# EAGLE design clock-matrix (EAGLE 9.6.2)
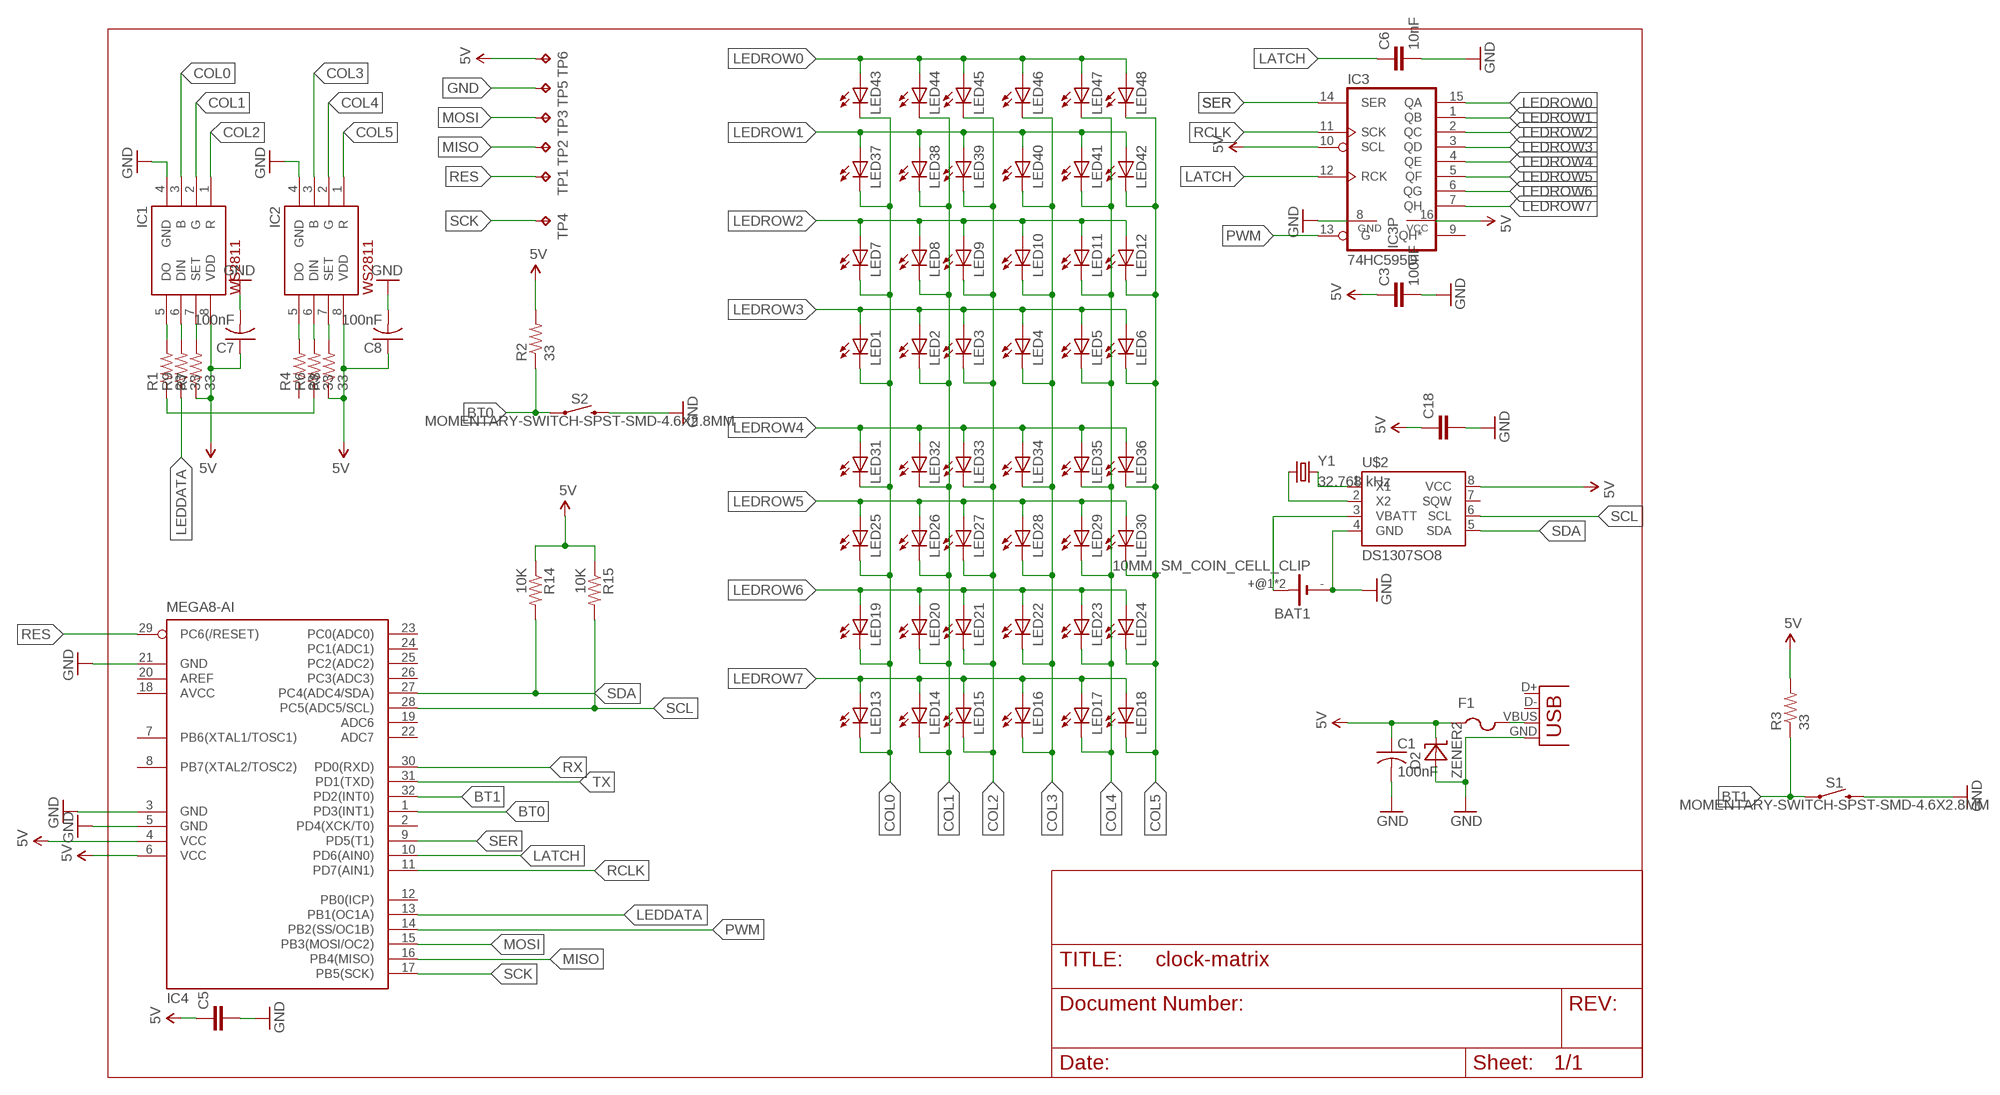
[diagram p0: schematic, sheet 1]

## Parts
BAT1  10MM_SM_COIN_CELL_CLIP  [10MM_SM_COIN_CELL_CLIP]
C1  100nF  C-USC0603  [C0603]
C3  100nF  C-EUC0603  [C0603]
C5  C-EUC0603  [C0603]
C6  10nF  C-EUC0603  [C0603]
C7  100nF  C-USC0603  [C0603]
C8  100nF  C-USC0603  [C0603]
C18  C-EUC0603  [C0603]
D2  ZENER2  [SOD123]
F1  PTCFUSE-1206  [R1206]
IC1  WS2811-SOP8  [SO08-SKINNYPADS]
IC2  WS2811-SOP8  [SO08-SKINNYPADS]
IC3  74HC595D  [SO16]
IC4  MEGA8-AI  [TQFP32-08]
LED1  LED1206  [LED-1206]
LED2  LED1206  [LED-1206]
LED3  LED1206  [LED-1206]
LED4  LED1206  [LED-1206]
LED5  LED1206  [LED-1206]
LED6  LED1206  [LED-1206]
LED7  LED1206  [LED-1206]
LED8  LED1206  [LED-1206]
LED9  LED1206  [LED-1206]
LED10  LED1206  [LED-1206]
LED11  LED1206  [LED-1206]
LED12  LED1206  [LED-1206]
LED13  LED1206  [LED-1206]
LED14  LED1206  [LED-1206]
LED15  LED1206  [LED-1206]
LED16  LED1206  [LED-1206]
LED17  LED1206  [LED-1206]
LED18  LED1206  [LED-1206]
LED19  LED1206  [LED-1206]
LED20  LED1206  [LED-1206]
LED21  LED1206  [LED-1206]
LED22  LED1206  [LED-1206]
LED23  LED1206  [LED-1206]
LED24  LED1206  [LED-1206]
LED25  LED1206  [LED-1206]
LED26  LED1206  [LED-1206]
LED27  LED1206  [LED-1206]
LED28  LED1206  [LED-1206]
LED29  LED1206  [LED-1206]
LED30  LED1206  [LED-1206]
LED31  LED1206  [LED-1206]
LED32  LED1206  [LED-1206]
LED33  LED1206  [LED-1206]
LED34  LED1206  [LED-1206]
LED35  LED1206  [LED-1206]
LED36  LED1206  [LED-1206]
LED37  LED1206  [LED-1206]
LED38  LED1206  [LED-1206]
LED39  LED1206  [LED-1206]
LED40  LED1206  [LED-1206]
LED41  LED1206  [LED-1206]
LED42  LED1206  [LED-1206]
LED43  LED1206  [LED-1206]
LED44  LED1206  [LED-1206]
LED45  LED1206  [LED-1206]
LED46  LED1206  [LED-1206]
LED47  LED1206  [LED-1206]
LED48  LED1206  [LED-1206]
R1  33  R-US_R0603  [R0603]
R2  33  R-US_R0603  [R0603]
R3  33  R-US_R0603  [R0603]
R4  33  R-US_R0603  [R0603]
R6  33  R-US_R0603  [R0603]
R7  33  R-US_R0603  [R0603]
R8  33  R-US_R0603  [R0603]
R9  33  R-US_R0603  [R0603]
R14  10K  R-US_R0603  [R0603]
R15  10K  R-US_R0603  [R0603]
S1  MOMENTARY-SWITCH-SPST-SMD-4.6X2.8MM  [TACTILE_SWITCH_SMD_4.6X2.8MM]
S2  MOMENTARY-SWITCH-SPST-SMD-4.6X2.8MM  [TACTILE_SWITCH_SMD_4.6X2.8MM]
TP1  TPTP10R  [TP10R]
TP2  TPTP10R  [TP10R]
TP3  TPTP10R  [TP10R]
TP4  TPTP10R  [TP10R]
TP5  TPTP10R  [TP10R]
TP6  TPTP10R  [TP10R]
U$2  DS1307SO8  [SO08]
X2  USB-MICROB  [USB-MICROB]
Y1  32.768 kHz  CRYSTALTC26H  [TC26H]

## Nets
5V: C1.1 C3.1 C5.1 C7.1 C8.1 C18.1 D2.C F1.1 IC1.8(VDD) IC2.8(VDD) IC3.10(SCL) IC3.16(VCC) IC4.4(VCC) IC4.6(VCC) R2.2 R3.2 R7.1 R8.1 R14.1 R15.1 TP6.TP U$2.8(VCC)
BT0: IC4.1(PD3(INT1)) R2.1 S2.1 S2.2
BT1: IC4.32(PD2(INT0)) R3.1 S1.1 S1.2
COL0: IC1.3(B) LED1.C LED7.C LED13.C LED19.C LED25.C LED31.C LED37.C LED43.C
COL1: IC1.2(G) LED2.C LED8.C LED14.C LED20.C LED26.C LED32.C LED38.C LED44.C
COL2: IC1.1(R) LED3.C LED9.C LED15.C LED21.C LED27.C LED33.C LED39.C LED45.C
COL3: IC2.3(B) LED4.C LED10.C LED16.C LED22.C LED28.C LED34.C LED40.C LED46.C
COL4: IC2.2(G) LED5.C LED11.C LED17.C LED23.C LED29.C LED35.C LED41.C LED47.C
COL5: IC2.1(R) LED6.C LED12.C LED18.C LED24.C LED30.C LED36.C LED42.C LED48.C
GND: BAT1.- C1.2 C3.2 C5.2 C6.2 C7.2 C8.2 C18.2 D2.A IC1.4(GND) IC2.4(GND) IC3.8(GND) IC4.3(GND) IC4.5(GND) IC4.21(GND) S1.3 S1.4 S2.3 S2.4 TP5.TP U$2.4(GND) X2.GND
LATCH: C6.1 IC3.12(RCK) IC4.10(PD6(AIN0))
LEDDATA: IC4.13(PB1(OC1A)) R9.1
LEDROW0: IC3.15(QA) LED43.A LED44.A LED45.A LED46.A LED47.A LED48.A
LEDROW1: IC3.1(QB) LED37.A LED38.A LED39.A LED40.A LED41.A LED42.A
LEDROW2: IC3.2(QC) LED7.A LED8.A LED9.A LED10.A LED11.A LED12.A
LEDROW3: IC3.3(QD) LED1.A LED2.A LED3.A LED4.A LED5.A LED6.A
LEDROW4: IC3.4(QE) LED31.A LED32.A LED33.A LED34.A LED35.A LED36.A
LEDROW5: IC3.5(QF) LED25.A LED26.A LED27.A LED28.A LED29.A LED30.A
LEDROW6: IC3.6(QG) LED19.A LED20.A LED21.A LED22.A LED23.A LED24.A
LEDROW7: IC3.7(QH) LED13.A LED14.A LED15.A LED16.A LED17.A LED18.A
MISO: IC4.16(PB4(MISO)) TP2.TP
MOSI: IC4.15(PB3(MOSI/OC2)) TP3.TP
N$1: R1.1 R6.1
N$2: IC1.5(DO) R1.2
N$3: IC2.6(DIN) R6.2
N$4: IC1.7(SET) R7.2
N$5: IC2.5(DO) R4.2
N$7: IC1.6(DIN) R9.2
N$9: BAT1.+@1(+) BAT1.+@2(+) U$2.3(VBATT)
N$10: U$2.2(X2) Y1.1
N$11: U$2.1(X1) Y1.2
N$13: IC2.7(SET) R8.2
N$41: F1.2 X2.VBUS
PWM: IC3.13(G) IC4.14(PB2(SS/OC1B))
RCLK: IC3.11(SCK) IC4.11(PD7(AIN1))
RES: IC4.29(PC6(/RESET)) TP1.TP
RX: IC4.30(PD0(RXD))
SCK: IC4.17(PB5(SCK)) TP4.TP
SCL: IC4.28(PC5(ADC5/SCL)) R15.2 U$2.6(SCL)
SDA: IC4.27(PC4(ADC4/SDA)) R14.2 U$2.5(SDA)
SER: IC3.14(SER) IC4.9(PD5(T1))
TX: IC4.31(PD1(TXD))
Unconnected: IC3.9(QH*) IC4.2(PD4(XCK/T0)) IC4.7(PB6(XTAL1/TOSC1)) IC4.8(PB7(XTAL2/TOSC2)) IC4.12(PB0(ICP)) IC4.19(ADC6) IC4.20(AREF) IC4.22(ADC7) IC4.23(PC0(ADC0)) IC4.24(PC1(ADC1)) IC4.25(PC2(ADC2)) IC4.26(PC3(ADC3)) R4.1 U$2.7(SQW) X2.D+ X2.D-

## Power pins joined to a net without a drawn wire
AVCC: IC4.18(AVCC)

## Library data of the parts
BAT1 = battery:10MM_SM_COIN_CELL_CLIP: Battery cell clip for CR927 Source: KEYSTONE ELECTRONICS CORP. www.keyelco.com, ASTORIA, N.Y. 11105-2017 PART ANME 10mm SM COIN CELl CLIP DWG NO. 3030
C1 C7 C8 = adafruit:C-US: CAPACITOR, American symbol
C3 C5 C6 C18 = rcl:C-EU: CAPACITOR, European symbol
D2 = smt_diodes:ZENER
F1 = adafruit:PTCFUSE: PTC fuses, resettable thermistors
IC1 IC2 = adafruit:WS2811
IC3 = 74xx-eu:74*595: 8-bit SHIFT REGISTER, output latch
IC4 = atmel:MEGA8: MICROCONTROLLER 8 Kbytes FLASH, 1 kbytes SRAM, 512 bytes EEPROM, USART, 6-channel 10 bit ADC, 2-channel 8 bit ADC Pin compatible with Atmega48, ATMega88, ATMega168 Source: avr.lbr; MPN: ATMEGA8-16AU; OC_FARNELL: 9171371; OC_NEWARK: 73M8863
LED1-LED48 = SparkFun:LED: LEDs Standard schematic elements and footprints for 5mm, 3mm, 1206, and 0603 sized LEDs. 5mm - Spark Fun Electronics SKU : COM-00529 (and others)
R1-R4 R6-R9 = adafruit:R-US_: RESISTOR, American symbol
R14 R15 = rcl:R-US_: RESISTOR, American symbol
S1 S2 = SparkFun-Switches:MOMENTARY-SWITCH-SPST: Momentary Switch (Pushbutton) - SPST Normally-open (NO) SPST momentary switches (buttons, pushbuttons). Variants PTH-12MM - 12mm square, through-hole Momentary Pushbutton Switch - 12mm Square <https://www.sparkfun.com/products/9190> (COM-09190) PTH-6.0MM, PTH-6.0MM-KIT - 6.0mm square, through-hole Mini Pushbutton Switch <https://www.sparkfun.com/products/97> (COM-00097) KIT package intended for soldering kit's - only one side of pads' copper is exposed. PTH-RIGHT-ANGLE-KIT - Right-angle, through-hole Right Angle Tactile Button <https://www.sparkfun.com/products/10791> - Used on SparkFun BigTime Watch Kit <https://www.sparkfun.com/products/11734> SMD-12MM - 12mm square, surface-mount Tactile Button - SMD (12mm) <https://www.sparkfun.com/products/12993> (COM-12993) Used on SparkFun PicoBoard <https://www.sparkfun.com/products/11888> SMD-4.5MM - 4.5mm Square Trackball Switch Used on SparkFun Blackberry Trackballer Breakout <https://www.sparkfun.com/products/13169> SMD-4.6MMX2.8MM - 4.60mm x 2.80mm, surface mount Used on SparkFun SAMD21 Mini Breakout <https://www.sparkfun.com/products/13664> SMD-5.2MM, SMD-5.2-REDUNDANT - 5.2mm square, surface-mount Mini Pushbutton Switch - SMD <https://www.sparkfun.com/products/8720> (COM-08720) Used on Arduino Pro Mini <https://www.sparkfun.com/products/11114> REDUNDANT package connects both switch circuits together SMD-6.0X3.5MM - 6.0 x 3.5mm, surface mount Momentary Reset Switch SMD <https://www.sparkfun.com/products/8229> (COM-08229) SMD-6.2MM-TALL - 6.2mm square, surface mount Tactile Button - SMD (6mm) <https://www.sparkfun.com/products/12992> Used on SparkFun Digital Sandbox <https://www.sparkfun.com/products/12651> SMD-RIGHT-ANGLE - Right-angle, surface mount Used on SparkFun Block for Intel® Edison - Arduino <https://www.sparkfun.com/products/13036>; PROD_ID: SWCH-13065
TP1-TP6 = testpad:TP: Test pad
U$2 = SparkFun:DS1307
X2 = SparkFun:USB: USB Connectors USB-B-PTH is fully proven SKU : PRT-00139 USB-miniB is fully proven SKU : PRT-00587 USB-A-PCB is untested. USB-A-H is throughly reviewed, but untested. Spark Fun Electronics SKU : PRT-00437 USB-B-SMT is throughly reviewed, but untested. Needs silkscreen touching up. USB-A-S has not been used/tested USB-MB-H has not been used/tested
Y1 = SparkFun:CRYSTAL: Crystals Various standard crystals. Proven footprints. Spark Fun Electronics SKU : COM-00534

## Board
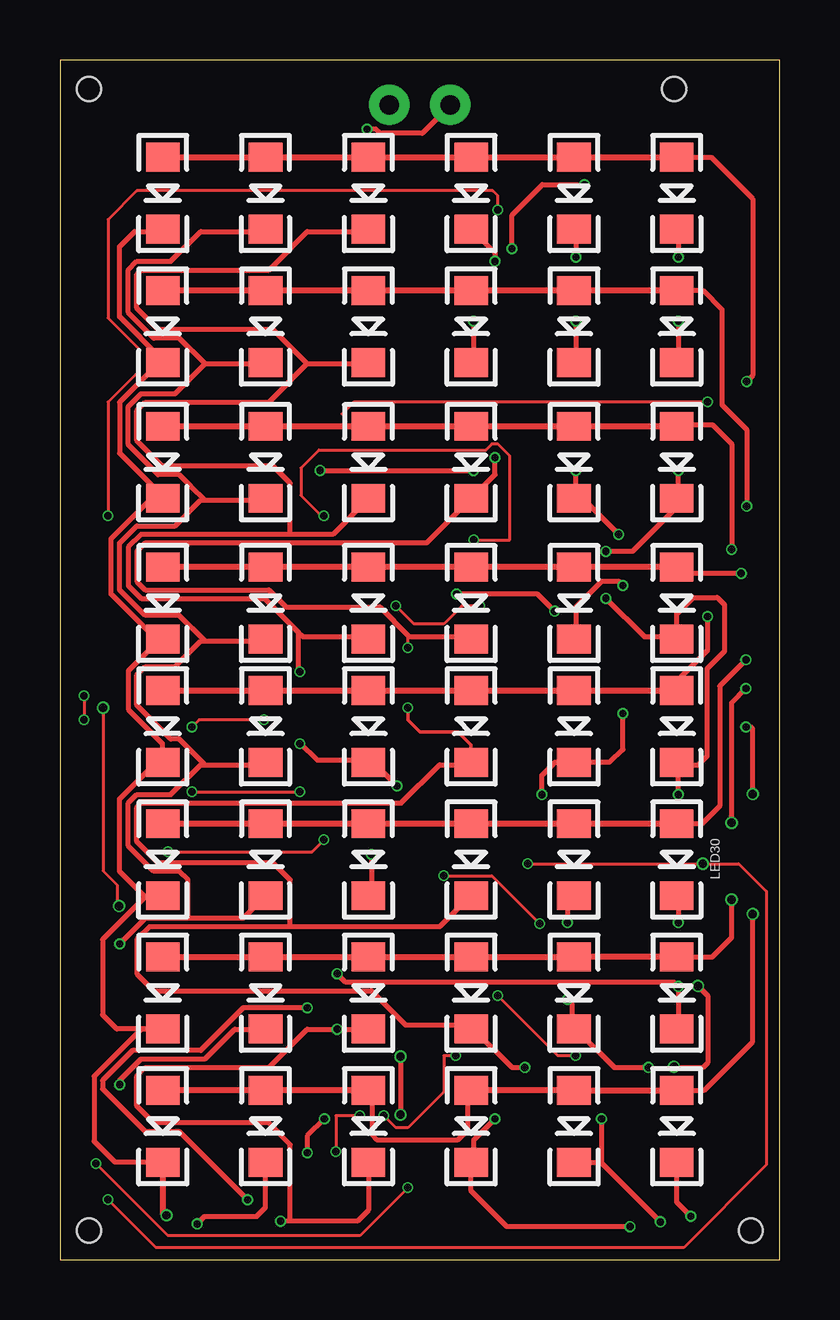
[diagram p1: board, top side]
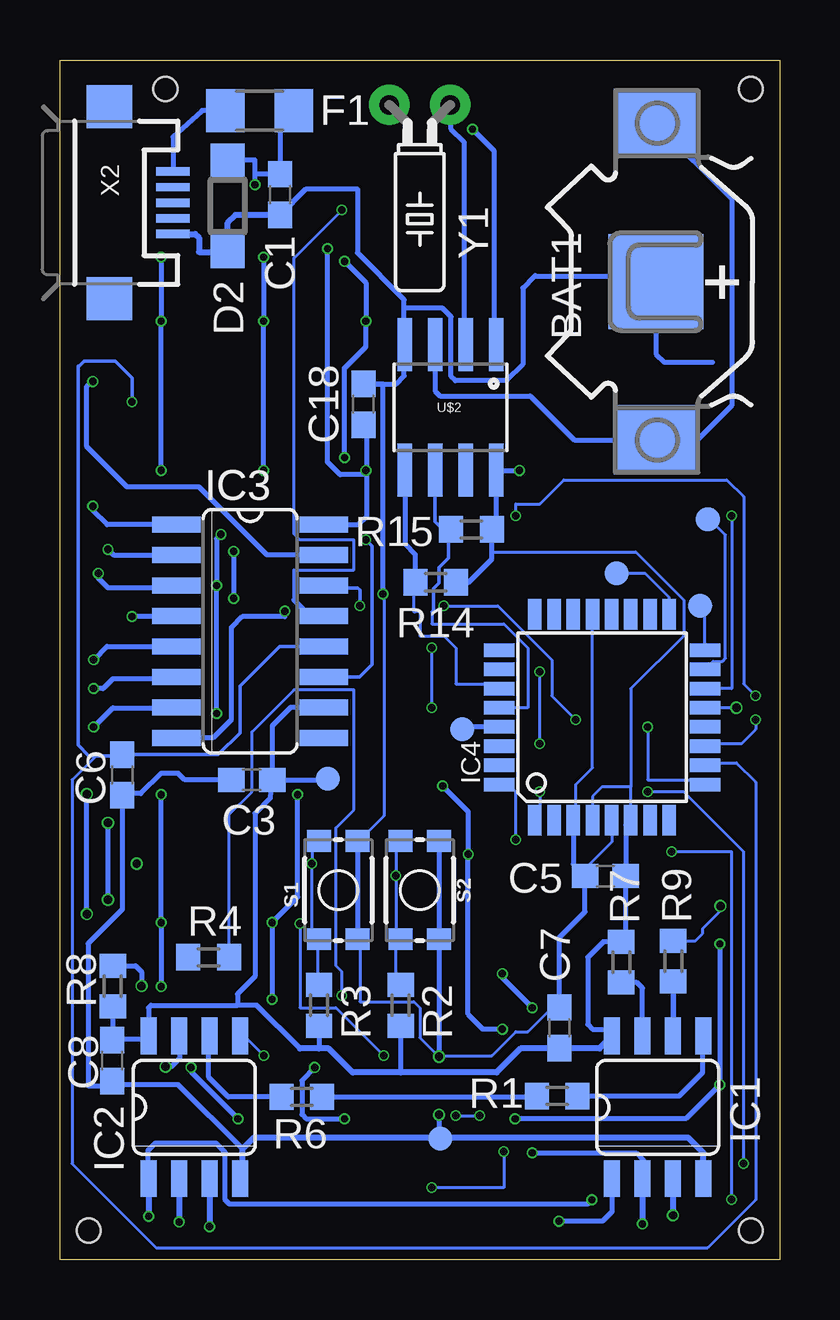
[diagram p2: board, bottom side, seen from below]

Size 30 x 50 mm. Coordinates in mm from the lower left corner, seen from the top.
Outline: 0,0 30,0 30,50 0,50 0,0
Copper layers (1*16): Top 0.035mm / dielectric 1.6mm / Bottom 0.035mm
Design rules "jlcpcb-2layers *": minimum track width 5mil, minimum drill 0.3mm, track to track 5mil, track to pad 5mil, pad to pad 5mil, via to via 5mil, smd to smd 5mil, copper to edge 0.2mm, drill to drill 6mil, minimum pad ring 10mil, minimum via ring 3mil, stop-mask expansion 4mil, vias tented up to drill 14mil, thermal gap 10mil
Holes 1 mm at 1.2,1.2 28.8,1.2 1.2,48.8 25.6,48.8

### Footprints (pad centres in the part's own frame; a part is rotated, then mirrored left to right if it is on the bottom)
10MM_SM_COIN_CELL_CLIP = smd 2.9 x 3.5: +@1 -6.6,0; +@2 6.6,0 | smd 3.96 x 3.96: - 0,0
C0603 = smd 1.1 x 1: 1 -0.85,0; 2 0.85,0
SOD123 = smd 1.4 x 1.4: A 1.9,0; C -1.9,0
R1206 = smd 1.6 x 1.803: 1 -1.422,0; 2 1.422,0
SO08-SKINNYPADS = smd 0.66 x 1.524: 1 -1.905,-2.973; 2 -0.635,-2.973; 3 0.635,-2.973; 4 1.905,-2.973; 5 1.905,2.973; 6 0.635,2.973; 7 -0.635,2.973; 8 -1.905,2.973
SO16 = smd 0.66 x 2.032: 1 -4.445,-3.073; 2 -3.175,-3.073; 3 -1.905,-3.073; 4 -0.635,-3.073; 5 0.635,-3.073; 6 1.905,-3.073; 7 3.175,-3.073; 8 4.445,-3.073; 9 4.445,3.073; 10 3.175,3.073; 11 1.905,3.073; 12 0.635,3.073; 13 -0.635,3.073; 14 -1.905,3.073; 15 -3.175,3.073; 16 -4.445,3.073
TQFP32-08 = smd 1.27 x 0.559: 1 -4.293,2.8; 2 -4.293,2; 3 -4.293,1.2; 4 -4.293,0.4; 5 -4.293,-0.4; 6 -4.293,-1.2; 7 -4.293,-2; 8 -4.293,-2.8; 17 4.293,-2.8; 18 4.293,-2; 19 4.293,-1.2; 20 4.293,-0.4; 21 4.293,0.4; 22 4.293,1.2; 23 4.293,2; 24 4.293,2.8 | smd 0.559 x 1.27: 9 -2.8,-4.293; 10 -2,-4.293; 11 -1.2,-4.293; 12 -0.4,-4.293; 13 0.4,-4.293; 14 1.2,-4.293; 15 2,-4.293; 16 2.8,-4.293; 25 2.8,4.293; 26 2,4.293; 27 1.2,4.293; 28 0.4,4.293; 29 -0.4,4.293; 30 -1.2,4.293; 31 -2,4.293; 32 -2.8,4.293
LED-1206 = smd 1.2 x 1.4: A -1.5,0; C 1.5,0
R0603 = smd 1 x 1.1: 1 -0.85,0; 2 0.85,0
TACTILE_SWITCH_SMD_4.6X2.8MM = smd 0.9 x 1: 1 -2.05,-0.8; 2 2.05,-0.8; 3 2.05,0.8; 4 -2.05,0.8
TP10R = smd 1 x 1: TP 0,0
SO08 = smd 0.61 x 2.21: 1 -1.905,-2.616; 2 -0.635,-2.616; 3 0.635,-2.616; 4 1.905,-2.616; 5 1.905,2.616; 6 0.635,2.616; 7 -0.635,2.616; 8 -1.905,2.616
USB-MICROB = smd 0.35 x 1.4: D+ 0,2.65; D- -0.65,2.65; GND 1.3,2.65; ID 0.65,2.65; VBUS -1.3,2.65 | smd 1.8 x 1.9: MT1 -4,0; MT2 4,0
TC26H = drill 0.813 pad 1.676: 1 -1.27,0; 2 1.27,0

### Placement (x,y rotation side)
BAT1  5.15,40.76 270 bottom
C1  20.83,44.39 270 bottom
C3  22,20 180 bottom
C5  7.26,15.98 180 bottom
C6  27.4,20.2 270 bottom
C7  9.17,9.66 90 bottom
C8  27.83,8.29 270 bottom
C18  17.34,35.65 90 bottom
D2  23.01,43.92 270 bottom
F1  21.68,47.89 180 bottom
IC1  5.08,6.35 0 bottom
IC2  24.4,6.35 0 bottom
IC3  22.07,26.19 270 bottom
IC4  7.4,22.6 90 bottom
LED1  4.29,27.36 270 top
LED2  8.57,27.36 270 top
LED3  12.86,27.36 270 top
LED4  17.14,27.36 270 top
LED5  21.43,27.36 270 top
LED6  25.71,27.36 270 top
LED7  4.29,33.23 270 top
LED8  8.57,33.23 270 top
LED9  12.86,33.23 270 top
LED10  17.14,33.23 270 top
LED11  21.43,33.23 270 top
LED12  25.71,33.23 270 top
LED13  4.29,5.56 270 top
LED14  8.57,5.56 270 top
LED15  12.86,5.56 270 top
LED16  17.14,5.56 270 top
LED17  21.43,5.56 270 top
LED18  25.71,5.56 270 top
LED19  4.29,11.11 270 top
LED20  8.57,11.11 270 top
LED21  12.86,11.11 270 top
LED22  17.14,11.11 270 top
LED23  21.43,11.11 270 top
LED24  25.71,11.11 270 top
LED25  4.29,16.67 270 top
LED26  8.57,16.67 270 top
LED27  12.86,16.67 270 top
LED28  17.14,16.67 270 top
LED29  21.43,16.67 270 top
LED30  25.71,16.67 270 top
LED31  4.29,22.22 270 top
LED32  8.57,22.22 270 top
LED33  12.86,22.22 270 top
LED34  17.14,22.22 270 top
LED35  21.43,22.22 270 top
LED36  25.71,22.22 270 top
LED37  4.29,38.89 270 top
LED38  8.57,38.89 270 top
LED39  12.86,38.89 270 top
LED40  17.14,38.89 270 top
LED41  21.43,38.89 270 top
LED42  25.71,38.89 270 top
LED43  4.29,44.44 270 top
LED44  8.57,44.44 270 top
LED45  12.86,44.44 270 top
LED46  17.14,44.44 270 top
LED47  21.43,44.44 270 top
LED48  25.71,44.44 270 top
R1  9.27,6.82 0 bottom
R2  15.8,10.6 270 bottom
R3  19.2,10.6 270 bottom
R4  23.8,12.6 0 bottom
R6  19.92,6.78 180 bottom
R7  6.6,12.4 270 bottom
R8  27.8,11.4 90 bottom
R9  4.43,12.44 270 bottom
R14  14.33,28.23 180 bottom
R15  12.85,30.43 180 bottom
S1  18.4,15.4 270 bottom
S2  15,15.4 270 bottom
TP1  13.23,22.1 0 bottom
TP2  3.31,27.25 0 bottom
TP3  2.99,30.85 0 bottom
TP4  6.8,28.6 0 bottom
TP5  14.15,5.05 0 bottom
TP6  18.83,20.05 0 bottom
U$2  13.72,35.52 180 bottom
X2  27.94,44.05 270 bottom
Y1  15,48.13 180 bottom

### Tracks (layer width: path | path; a pad name or v marks a point on that pad's centre or on a via)
5V  (via drill 0.3)
  Top 0.203: v21.87,44.81 20.11,44.81 18.85,43.54 v18.85,42.14 | v10.85,32.89 v17.25,32.89
  Bottom 0.127: 6.2,19.7 7.4,19.7 7.8,19.3 IC4.4 | IC4.6 6.2,19.7 | 6.2,19.7 6.2,23.8 4,26 4,27.5 6,29.5 12,29.5
  Bottom 0.203: R14.1 13.45,28.2 13,28.2 12,29.2 12,29.5 R15.1 11.81,30.61 U$2.8 11.73,32.89 v10.85,32.89 | 21.87,45.24 C1.1 20.83,47.52 F1.1 | D2.C 22.99,45.84 21.87,45.84 21.87,45.24 | C8.1 27.77,9.2 | 27.77,9.2 26.3,9.2 | 20,8.8 21.8,10.6 22.6,10.6 | 22.6,10.6 26.2,10.6 26.3,10.49 IC2.8 | IC3.16 17.57,30.64 17.2,31 17.2,32.72 | 17.2,32.72 17.2,32.89 | 17.2,32.89 17.2,34.66 C18.1 | v21.87,44.81 21.87,45.24 | v18.85,42.14 18.85,33.25 18.31,32.72 17.2,32.72 | C7.1 9.25,8.89 9.25,8.8 | C3.1 21.22,19.25 21.87,18.6 21.87,11.8 22.6,11.07 22.6,10.6 | C3.1 18.88,20 TP6.TP 18.6,20.05 | v17.25,32.89 17.2,32.89 | IC3.10 20.39,23.02 21.15,22.25 C3.1 | R3.2 19.2,8.8 | R2.2 15.8,7.8 | IC1.8 6.99,9.6 7.8,9.6 8,9.8 8,12.6 7.35,13.25 R7.1 6.41,13.44 C5.1 6.41,18.1 IC4.6 | R8.1 27.8,9.23 27.77,9.2
  Bottom 0.254: IC1.8 7.51,8.8 9.25,8.8 10.8,8.8 11.8,7.8 15.8,7.8 17.8,7.8 18.8,8.8 19.2,8.8 20,8.8 | IC2.8 26.3,9.2
BT0  (via drill 0.3)
  Top 0.127: v5.5,19.5 v10,19.5 | v1.5,4 4.5,1 12.5,1 v14.5,3 | v11.5,4.5 11.5,6 v12.5,6 | v13.5,6 14,5.5 14.5,5.5 16,7 16,8.5 v16.5,8.5 | v20,14 18,16 v16,16
  Bottom 0.127: R2.1 16,11.5 16,13.25 S2.2 16,13.5 v16,16 16,17.25 S2.1 | v10,19.5 10,18.5 IC4.1 | v5.5,19.5 4,19.5 1.5,17 v1.5,4 | v14.5,3 11.5,3 v11.5,4.5 | v13.5,6 v12.5,6 | v16.5,8.5 18.5,10.5 20,10.5 v20,14
BT1  (via drill 0.3, 0.35)
  Top 0.127: v11,17.5 10.5,17 v4.5,17 | v2,2.5 4,0.5 26,0.5 29.45,3.95 29.45,15.35 28.3,16.5 v26.8,16.5 v19.5,16.5
  Bottom 0.127: R3.1 19.25,11.5 19.25,13.25 S1.2 19.25,13.5 19.5,13.75 v19.5,16.5 19.5,17.5 S1.1 | 19,17.5 S1.1 | 19.25,17.25 S1.1 | v11,17.5 11,19.5 11.5,20 IC4.32 | v4.5,17 2,17 v2,2.5
COL0  (via drill 0.35)
  Top 0.203: 4.09,32 2.49,33.6 2.49,35.74 4.27,37.52 | 4.09,32 4.27,31.83 LED7.C 4.09,32 | 4.27,37.52 2.49,39.29 2.49,42.23 3.11,42.85 4.27,42.85 LED43.C | 4.27,37.52 LED37.C | 4.09,25.78 4.27,25.96 LED1.C 4.09,25.78 | 4.09,25.78 2.85,24.54 2.85,22.94 4.27,21.51 4.27,20.8 LED31.C 4.27,20.62 3.91,20.62 2.49,19.2 2.49,16.18 3.56,15.11 | 3.56,15.11 1.78,13.34 1.78,10.2 2.37,9.61 LED19.C 4.27,9.6 3.38,9.6 1.42,7.64 1.42,4.93 2.3,4.06 LED13.C | 3.56,15.11 4.27,15.11 LED25.C | 4.09,32 2.13,30.05 2.13,27.74 4.09,25.78
  Top 0.254: LED13.C 4.29,1.91 4.4,1.8 v4.45,1.84
  Bottom 0.254: IC1.3 v4.45,1.84
COL1  (via drill 0.3)
  Top 0.2: 5.45,32.25 6.04,31.65
  Top 0.203: v5.71,1.49 6.03,1.8 8.2,1.8 8.57,2.17 LED14.C | v2.49,7.29 2.49,7.47 3.38,8.36 6.04,8.36 7.29,9.6 8.53,9.6 LED20.C | v2.49,13.16 3.56,14.22 5.33,14.22 | 5.33,14.22 7.64,14.22 8.53,15.11 LED26.C | 6.04,20.62 5.87,20.62 4.62,19.38 3.2,19.38 2.85,19.02 2.85,17.25 3.91,16.18 4.98,16.18 5.33,15.82 5.33,14.22 | 6.04,20.62 8.53,20.62 LED32.C | 6.04,25.78 5.87,25.78 4.8,24.71 3.56,24.71 3.2,24.36 3.2,23.11 4.62,21.69 4.98,21.69 6.04,20.62 | 6.04,25.78 8.53,25.78 LED2.C | 6.04,25.78 4.98,26.85 3.56,26.85 2.49,27.91 2.49,29.87 3.2,30.58 4.8,30.58 5.87,31.65 6.04,31.65 8.53,31.65 LED8.C | 6.04,37.34 8.53,37.34 LED38.C | 6.04,37.34 4.8,36.09 3.38,36.09 2.85,35.56 2.85,33.96 4.09,32.72 4.98,32.72 5.45,32.25 | 6.04,37.34 4.98,38.41 3.91,38.41 2.85,39.47 2.85,41.25 3.2,41.6 4.62,41.6 5.87,42.85 8.53,42.85 LED44.C | v10.31,4.45 10.31,5.16 v11.02,5.87
  Bottom 0.203: v2.49,13.16 v2.49,7.29 3.91,5.87 v11.02,5.87 | IC1.2 5.67,3.42 5.67,4.13 5.98,4.45 v10.31,4.45
  Bottom 0.254: IC1.2 v5.71,1.49
COL2  (via drill 0.3)
  Top 0.127: v10,21.5 10.02,21.52
  Top 0.203: LED15.C 12.86,2.06 12.4,1.6 9.6,1.6 | 9.6,1.6 v9.2,1.6 | 9.94,26.16 8.53,27.56 3.38,27.56 2.85,28.09 2.85,29.69 3.38,30.23 9.6,30.23 | 9.94,26.16 10.13,25.96 12.8,25.96 LED3.C | 9.6,30.23 11.38,30.23 12.8,31.65 LED9.C | 10.31,37.34 12.8,37.34 LED39.C | 10.31,37.34 8.71,35.74 3.56,35.74 3.2,35.38 3.2,34.14 4.27,33.07 8.89,33.07 9.6,32.36 9.6,30.23 | 10.31,37.34 8.89,38.76 4.09,38.76 3.2,39.65 3.2,41.07 3.38,41.25 8.71,41.25 10.31,42.85 12.8,42.85 LED45.C | v12.98,16.89 12.98,15.29 LED27.C | v14.05,19.74 12.98,20.8 LED33.C 12.8,20.8 10.73,20.8 10.02,21.52 | 9.6,1.6 9.6,4.8 8.71,5.69 3.91,5.69 3.2,6.4 3.2,7.64 3.56,8 8.71,8 10.31,9.6 v11.56,9.6 12.8,9.6 LED21.C | v10,24.5 9.94,24.57 9.94,26.16
  Bottom 0.127: v10,21.5 v10,24.5
  Bottom 0.2: 6.99,3 6.99,2 7.38,1.6 7.4,1.6
  Bottom 0.203: 7.4,1.6 v9.2,1.6 | v14.05,19.74 12.98,18.67 v12.98,16.89 12.98,10.22 12.36,9.6 v11.56,9.6
  Bottom 0.254: 6.99,3 IC1.1
COL3  (via drill 0.3)
  Top 0.127: v14.5,25.5 14.5,26 14.52,26.02
  Top 0.152: LED34.C 17.14,21.46 16.6,22 15,22 14.5,22.5 v14.5,23
  Top 0.2: 20,1.37 18.63,1.37 17.14,2.86 LED16.C
  Top 0.203: v23.77,1.37 20,1.37 | v17.25,39.12 17.25,37.52 LED40.C | v18.14,41.6 18.14,41.96 17.25,42.85 LED46.C | LED4.C 17.07,25.96 14.58,25.96 14.52,26.02 13.34,27.2 9.42,27.2 8.71,27.91 3.56,27.91 3.2,28.27 3.2,29.52 3.56,29.87 15.29,29.87 17.07,31.65 LED10.C 17.25,31.83 18.14,32.72 v18.14,33.43 | 9.6,13.87 15.82,13.87 17.07,15.11 LED28.C | 9.6,13.87 3.73,13.87 3.2,13.34 3.2,11.91 3.91,11.2 12.98,11.2 14.4,9.78 17.07,9.78 LED22.C 17.25,9.6 18.85,8 v19.38,8 | 9.6,13.87 9.6,15.82 8.89,16.54 4.09,16.54 3.2,17.42 3.2,18.85 3.38,19.02 14.22,19.02 15.82,20.62 17.07,20.62 LED34.C | v18.14,5.87 17.25,4.98 17.25,4.09 LED16.C
  Bottom 0.127: v14.5,23 v14.5,25.5
  Bottom 0.203: v18.14,41.6 17.25,40.72 v17.25,39.12 17.25,38.05 18.14,37.16 v18.14,33.43 | v18.14,5.87 19.74,5.87 19.91,6.04 19.91,7.47 v19.38,8
  Bottom 0.254: IC2.3 v23.77,1.37
COL4  (via drill 0.3)
  Top 0.203: LED17.C 22.54,4.06 22.55,4.05 | 22.55,4.05 v25.04,1.56 | v21.51,39.12 21.51,37.52 LED41.C | v21.51,41.78 21.51,42.85 LED47.C | v23.47,28.09 23.29,28.27 22.58,28.27 21.51,27.2 21.51,25.96 LED5.C | v23.29,30.23 21.79,31.73 LED11.C 21.51,31.83 v21.51,32.89 | v21.16,10.85 21.34,10.67 21.34,9.78 LED23.C 21.51,9.6 23.11,8 v24.54,8 | v21.16,14.05 21.16,14.94 21.34,15.11 LED29.C | v20.09,19.38 20.09,20.18 20.63,20.72 LED35.C 22.91,20.72 23.47,21.25 v23.47,22.76 | v22.58,5.87 22.58,4.09 22.55,4.05
  Bottom 0.203: v21.51,41.78 v21.51,39.12 v21.51,32.89 | v23.29,30.23 23.47,30.05 v23.47,28.09 v23.47,22.76 | v21.16,10.85 v21.16,14.05 20.09,15.11 v20.09,19.38 | v22.58,5.87 24.54,7.82 v24.54,8
  Bottom 0.254: IC2.2 v25.04,1.56
COL5  (via drill 0.3)
  Top 0.203: LED18.C 25.71,2.39 v26.3,1.8 | v25.78,39.12 25.78,37.52 LED42.C | v25.78,41.78 25.78,42.85 LED48.C | v22.76,27.56 24.36,25.96 25.6,25.96 LED6.C 25.71,26.91 26.4,27.6 27.4,27.6 27.7,27.3 27.7,25.35 26.97,24.62 26.97,20.97 26.6,20.6 25.78,20.6 | v22.76,29.52 23.87,29.52 25.71,31.36 LED12.C 25.78,31.83 v25.78,32.89 | v25.78,14.05 25.78,15.11 LED30.C | LED24.C 25.78,9.78 v25.78,11.38 25.6,11.56 11.91,11.56 v11.56,11.91 | v25.78,19.38 25.78,20.6 | 25.78,20.6 25.78,20.62 LED36.C | v7.82,2.49 4.98,5.33 3.56,5.33 1.78,7.11 1.78,7.47 3.02,8.71 5.87,8.71 7.64,10.49 v10.31,10.49
  Bottom 0.203: v25.78,41.78 v25.78,39.12 v25.78,32.89 | v22.76,29.52 v22.76,27.56 | v25.78,11.38 v25.78,14.05 v25.78,19.38 | IC2.1 26.34,3.41 26.34,4.53 26.02,4.84 23.49,4.84 23.11,4.47 23.11,2.49 22.94,2.31 8,2.31 v7.82,2.49 | v10.31,10.49 11.56,11.73 v11.56,11.91
  Bottom 0.254: IC2.1 v26.3,1.8
GND  (via drill 0.3, 0.35)
  Top 0.203: v16.54,27.74 19.91,27.74 v20.62,27.03 | v14.2,8.46 v14.2,6.04
  Bottom 0.127: 25,21.75 IC3.8 | 17.62,13.38 S1.3 17.5,13.25 17.5,10.75 15.25,10.75 15,10.5 15,9.25 14.25,8.5 v14.2,8.46 14,8.5 12,8.5 11,9.5 10.5,9.5 9.5,10.5 C7.2 | C5.2 8.11,16.29 7,17.4 IC4.5 | IC4.21 7.8,20.5 8.5,19.8 8.5,18.5 IC4.3 | S1.4 17.5,17.5 16.5,18.5 16.5,28 16.54,28
  Bottom 0.203: 23.23,42.02 D2.A 23.02,42 | 14.06,5.05 TP5.TP 14.03,5.05 14,5.08 | C3.2 24.8,20 25.07,20.27 25.78,20.27 26.62,19.43 27.32,19.43 C6.2 27.4,14.6 28.83,13.17 28.83,7.24 28.03,7.24 C8.2 27.83,7.29 25.07,7.29 22.39,4.61 | C1.2 20.8,43.56 19.74,44.63 17.6,44.63 17.6,41.96 15.65,40.01 15.65,39.65 | 15.65,38.23 15.65,36.83 15.97,36.5 C18.2 16.54,36.5 16.54,28 v16.54,27.74 | 15.65,38.23 15.65,39.65 | 15.65,38.23 U$2.4 | 15.65,39.65 14.05,39.65 13.69,39.29 13.69,36.8 13.51,36.63 11.38,36.63 10.7,37.3 10.7,40.5 10.24,40.96 | 9.25,10.67 C7.2 9.17,13.43 8.11,14.49 C5.2 8.6,16.47 IC4.3 | v20.62,27.03 20.62,26.8 22.4,26.8 22.85,26.35 22.85,22.52 23.62,21.75 25,21.75 | 10.24,40.96 5.35,40.96 BAT1.- 5.15,37.75 4.8,37.4 2.8,37.4 | 10.24,40.96 10.18,41.02 | 14.2,8.4 v14.2,8.46 S2.3 14.07,13.47 14.2,13.6 S2.4 | v14.2,6.04 14.2,5.08 | S1.4 17.6,13.4 17.62,13.38
  Bottom 0.254: IC1.4 3.17,4.45 3.81,5.08 14,5.08 14.2,5.08 21.92,5.08 22.39,4.61 22.4,4.6 22.4,3.47 IC2.4 | X2.GND 24.36,42.75 24.2,42.59 24.2,42 23.02,42 | C1.2 22.68,43.54 23.01,43.21 D2.A
LATCH  (via drill 0.3)
  Top 0.127: 11.75,35.25 12.25,35.75 v27,35.75
  Bottom 0.127: 29.25,37.25 29.2,37.25 | IC4.10 3.01,20.7 1.8,20.7 1,19.9 1,2.5 3,0.5 26,0.5 29.5,4 29.5,20 28.5,21
  Bottom 0.152: 29.25,37.25 29.25,21.45 28.8,21 28.5,21 27.45,21 C6.1 23.4,21.05 22.5,21.95 22.5,23.9 20.84,25.55 IC3.12 | 29.2,37.25 29,37.45 27.7,37.45 27,36.75 v27,35.75
LEDDATA  (via drill 0.35)
  Top 0.127: v1.8,23 1.8,16.2 2.4,15.6 2.4,14.8 v2.47,14.73
  Bottom 0.127: v1.8,23 IC4.13 | R9.1 3.51,13.29 3.2,13.6 3.2,13.8 2.47,14.53 v2.47,14.73
LEDROW0  (via drill 0.3)
  Top 0.2: LED48.A 27.16,45.94 28.88,44.22 28.88,36.85 v28.63,36.6
  Top 0.254: LED43.A LED44.A LED45.A LED46.A LED47.A LED48.A
  Bottom 0.203: IC3.15 21.36,29.36 24.2,32.2 27.2,32.2 28.88,33.88 28.88,36.4 28.68,36.6 v28.63,36.6
LEDROW1  (via drill 0.3)
  Top 0.203: v28.63,31.4 28.63,34.6 27.6,35.63 27.6,39.6 26.8,40.4 25.73,40.4 LED42.A
  Top 0.254: LED42.A LED41.A LED40.A LED39.A LED38.A LED37.A
  Bottom 0.203: IC3.1 28.04,30.64 28.63,31.23 v28.63,31.4
LEDROW2  (via drill 0.3)
  Top 0.203: LED12.A 25.78,34.8 27.2,34.8 28,34 v28,29.6
  Top 0.254: LED7.A LED8.A LED9.A LED10.A LED11.A LED12.A
  Bottom 0.203: v28,29.6 27.77,29.36 IC3.2
LEDROW3  (via drill 0.3)
  Top 0.203: v28.4,28.6 25.97,28.6 LED6.A
  Top 0.254: LED6.A LED5.A LED4.A LED3.A LED2.A LED1.A
  Bottom 0.203: IC3.3 25.24,28 28,28 28.4,28.4 v28.4,28.6
LEDROW4  (via drill 0.3)
  Top 0.203: LED36.A 25.71,24.12 27,25.41 v27,26.8
  Top 0.254: LED31.A LED32.A LED33.A LED34.A LED35.A LED36.A
  Bottom 0.203: v27,26.8 26.98,26.82 IC3.4
LEDROW5  (via drill 0.3)
  Top 0.203: LED30.A 26.77,18.17 27.5,18.9 27.5,23.9 v28.6,25
  Top 0.254: LED30.A LED29.A LED28.A LED27.A LED26.A LED25.A
  Bottom 0.203: IC3.5 28.05,25.55 v28.6,25
LEDROW6  (via drill 0.3, 0.35)
  Top 0.203: v28.6,23.8 28,23.2 v28,18.2 | LED24.A 27.19,12.61 28,13.42 v28,15
  Top 0.254: LED19.A LED20.A LED21.A LED22.A LED23.A LED24.A
  Bottom 0.203: IC3.6 25.23,24.2 27.8,24.2 28.2,23.8 v28.6,23.8 | v28,15 v28,18.2
LEDROW7  (via drill 0.3, 0.35)
  Top 0.203: LED18.A 26.86,7.06 28.88,9.08 v28.88,14.4 | v28.88,19.4 28.88,22.12 28.8,22.2 v28.6,22.2 | LED15.A 13,6.91 13,5.2 13.2,5 16.6,5 17,5.4 17,7.06
  Top 0.254: LED18.A LED17.A LED16.A 17,7.06 | LED15.A LED14.A LED13.A
  Bottom 0.203: v28.6,22.2 27.8,23 25.8,23 25.79,23.02 IC3.7 | v28.88,14.4 28.88,19.32 28.8,19.4 v28.88,19.4
MISO
  Bottom 0.127: IC4.16 3.11,27.05 TP2.TP
MOSI
  Bottom 0.127: IC4.15 2.78,24.93 2.39,24.93 2.25,25.07 2.25,30.2 2.9,30.85 TP3.TP
N$1
  Bottom 0.203: R6.1 10.16,6.78 R1.1
N$2
  Bottom 0.203: R1.2 4.18,6.82 3.2,7.8 3.2,9.3 IC1.5
N$3
  Bottom 0.203: R6.2 22.98,6.78 23.8,7.6 23.8,9.29 IC2.6
N$4
  Bottom 0.203: IC1.7 5.71,11.31 5.95,11.55 R7.2
N$5  (via drill 0.3)
  Top 0.127: v18.25,11 20.75,8.5 v21.5,8.5
  Bottom 0.127: v18.25,11 18.25,12 18.5,12.25 18.5,18 17.75,18.75 17.75,23.75 20.25,23.75 22,22 22,19.5 22.95,18.55 R4.2 | v21.5,8.5 22.25,9.25 IC2.5
N$7
  Bottom 0.203: 4.43,9.5 R9.2 4.45,11.57 IC1.6 4.5,9.5 4.43,9.5 | 4.43,9.5 4.43,9.4
N$9
  Bottom 0.203: U$2.3 14.36,36.2 14.15,36 10.39,36 8.55,34.16 BAT1.+@2 5.15,33.95 4.8,33.6 4,33.6 2,35.6 2,44.21 BAT1.+@1
N$10
  Bottom 0.203: 13.71,48.12 13.71,47.14 13.16,46.58 13.16,38.23 U$2.2 | 13.71,48.12 13.51,48.01 13.69,48.01 Y1.1 13.71,48.12
N$11  (via drill 0.3)
  Top 0.203: v12.8,47.12 13.16,47.12 13.34,46.94 15.11,46.94 16.18,48.01 Y1.2
  Bottom 0.203: v12.8,47.12 11.91,46.23 11.91,38.23 U$2.1
N$13  (via drill 0.35)
  Top 0.203: v26.6,11.4 27,11 27,8.2 26.8,8 25.63,8 v25.6,8.03
  Bottom 0.203: R8.2 26.85,12.25 26.6,12 v26.6,11.4 | v25.6,8.03 25.37,8.03 25,8.4 25,9.29 IC2.7
N$41
  Bottom 0.203: F1.2 24.08,47.89 25.29,46.79 X2.VBUS
PWM  (via drill 0.3)
  Top 0.127: v18.25,43.75 18.25,44.35 18.05,44.55 3.2,44.55 2,43.35 2,39.25 3.25,38 3.25,37 2,35.75 v2,31
  Bottom 0.127: v18.25,43.75 20.25,41.75 20.25,30.25 20,30 17.75,30 17.75,28.75 20.25,28.75 20.25,27.5 | IC4.14 2,23.8 v2,31
  Bottom 0.2: IC3.13 19.57,26.82 20.25,27.5
RCLK  (via drill 0.3)
  Top 0.127: v17.25,30 18.75,30 18.75,33.5 18.25,34 18,34 17.75,33.75 10.8,33.75 10.05,33 10.05,31.85 10.9,31 v11,31 | v1,23.5 v1,22.5
  Bottom 0.127: v1,22.5 1,22.1 1.6,21.5 3,21.5 IC4.11 | v1,23.5 1.5,24 1.5,31.8 2.2,32.5 9,32.5 10,31.5 11,31.5 v11,31
  Bottom 0.152: IC3.11 17.52,24.29 17,24.8 17,29.75 v17.25,30
RES
  Bottom 0.203: IC4.29 13.13,22.2 TP1.TP
SCK
  Bottom 0.127: IC4.17 4.6,27.6 5.6,28.6 TP4.TP
  Bottom 0.203: TP4.TP 6.92,28.6
SCL
  Bottom 0.127: 13.6,30 13.79,30 | 13.79,30 14,30 | 13.79,30 R15.2 | IC4.28 10.5,23 10.5,25.5 11.5,26.5 14.5,26.5 14.5,27 14.43,27
  Bottom 0.152: U$2.6 14.36,30.75 13.6,30 | R15.2 13.8,30.33 13.8,29.25 14.2,28.85 14.2,28.2 14.43,27.97 14.43,27
SDA
  Bottom 0.127: R14.2 15.19,28.2 15.25,28 15.25,27 15.11,27.03 15,27 15,26 14,26 13.5,25.5 13.5,24 12,24 IC4.27
  Bottom 0.203: U$2.5 15.62,29.82 15.19,29.39 15.19,28.2
SER  (via drill 0.3)
  Top 0.127: v14,27.25 14.75,26.5 16,26.5 16.75,27.25 v17.5,27.25 | v5.5,22.2 5.8,22.5 v8.5,22.5
  Bottom 0.127: v5.5,22.2 5.5,20 3.5,20 IC4.9 | v8.5,22.5 9.5,23.5 9.5,25 11.75,27.25 v14,27.25
  Bottom 0.152: v17.5,27.25 17.5,27.9 17.6,28 18.9,28
  Bottom 0.203: 18.9,28 IC3.14

### Text on the board
bPlace: Matrix-Clock